# EAGLE design SPPM (EAGLE 6.3)
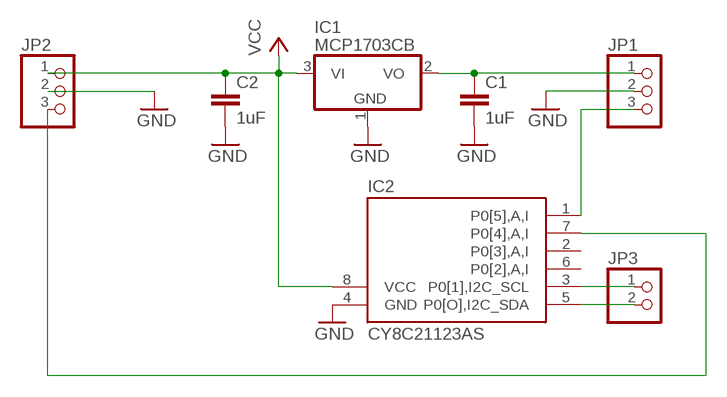
[diagram p0: schematic, sheet 1]

## Parts
C1  1uF  C-EUC0805  [C0805]
C2  1uF  C-EUC0805  [C0805]
IC1  MCP1703CB  [SOT23]
IC2  CY8C21123AS  [SOIC8]
JP1  PINHD-1X3  [1X03]
JP2  PINHD-1X3  [1X03]
JP3  PINHD-1X2  [1X02]

## Nets
GND [POWER]: C1.2 C2.2 IC1.1(GND) IC2.4(GND) JP1.2 JP2.2
N$1: IC2.7(P0[4],A,I) JP2.3
N$2: C1.1 IC1.2(VO) JP1.1
N$3: IC2.5(P0[O],I2C_SDA) JP3.2
N$4: IC2.3(P0[1],I2C_SCL) JP3.1
N$5: IC2.1(P0[5],A,I) JP1.3
VCC [POWER]: C2.1 IC1.3(VI) IC2.8(VCC) JP2.1
Unconnected: IC2.2(P0[3],A,I) IC2.6(P0[2],A,I)

## Library data of the parts
C1 C2 = rcl:C-EU: CAPACITOR, European symbol
IC1 = linear:MCP1703: 250 mA, 16V, Low Quiescent Current LDO Regulator Source: http://ww1.microchip.com/downloads/en/DeviceDoc/22049b.pdf
IC2 = rbl:CY8C21123: MICROCONTROLLER 4 Kbytes FLASH ROM; OC_FARNELL: unknown; OC_NEWARK: unknown
JP1 JP2 = pinhead:PINHD-1X3: PIN HEADER
JP3 = pinhead:PINHD-1X2: PIN HEADER

## Net classes
1 POWER: width 0.356 mm, clearance 0.305 mm

## Board
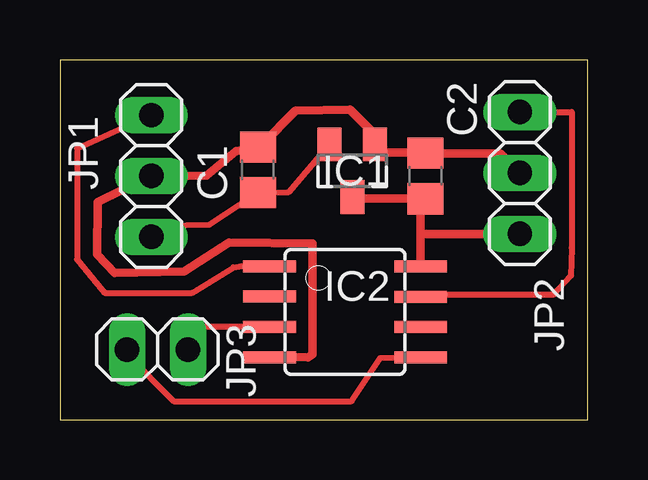
[diagram p1: board, top side]

Size 22 x 15 mm. Coordinates in mm from the lower left corner, seen from the top.
Outline: 0,0 22,0 22,15 0,15 0,0
Copper layers (1*16): Top 0.035mm / dielectric 1.5mm / Bottom 0.035mm
Design rules "LED *": minimum track width 10mil, minimum drill 0.8mm, track to track 18mil, track to pad 20mil, pad to pad 20mil, via to via 40mil, smd to smd 12mil, copper to edge 20mil, drill to drill 12mil, minimum pad ring 10mil, minimum via ring 10mil, stop-mask expansion 4mil, vias tented up to drill 0mil, thermal gap 10mil

### Footprints (pad centres in the part's own frame; a part is rotated, then mirrored left to right if it is on the bottom)
C0805 = smd 1.3 x 1.5: 1 -0.95,0; 2 0.95,0
SOT23 = smd 1 x 1.4: 1 -0.95,-1.1; 2 0.95,-1.1; 3 0,1.1
SOIC8 = smd 0.5 x 2.2: 1 -1.905,-3.154; 2 -0.645,-3.154; 3 0.625,-3.154; 4 1.895,-3.154; 5 1.905,3.154; 6 0.635,3.154; 7 -0.635,3.154; 8 -1.905,3.154
1X03 = drill 1.016 long: 1 -2.54,0; 2 0,0; 3 2.54,0
1X02 = drill 1.016 long: 1 -1.27,0; 2 1.27,0

### Placement (x,y rotation side)
C1  8.26,10.41 90 top
C2  15.24,10.16 90 top
IC1  12.19,10.38 180 top
IC2  11.89,4.49 270 top
JP1  3.81,10.16 90 top
JP2  19.18,10.29 90 top
JP3  4.06,2.92 180 top

### Tracks (layer width: path | path; a pad name or v marks a point on that pad's centre or on a via)
GND
  Top 0.356: IC1.1 13.16,11.46 13.49,11.12 15.24,11.12 C2.2 | 15.39,11.2 C2.2 | IC2.4 8.91,2.62 10.34,2.59 10.54,2.72 10.54,7.34 7.06,7.39 5.18,6.17 2.29,6.12 1.55,6.88 1.57,9.07 3.66,10.08 JP1.2 6.12,10.19 7.34,11.2 C1.2 8.41,11.46 9.83,12.88 12.09,12.93 13.03,11.99 IC1.1 | 13.11,11.66 IC1.1 | 13.08,11.81 IC1.1 | JP2.2 18.36,11.1 15.54,11.1 C2.2
N$1
  Top 0.254: 15.06,5.13 IC2.7 15.16,5.21 20.57,5.21 21.31,5.99 21.34,7.16 21.34,12.83 JP2.3
N$2
  Top 0.254: IC1.2 11.23,11.46 9.55,9.5 8.26,9.47 C1.1 8.15,9.4 6.22,8.13 4.29,8.1 JP1.1
N$3
  Top 0.254: JP3.2 2.79,2.72 4.75,0.76 12.17,0.76 13.36,2.56 IC2.5
N$4
  Top 0.254: JP3.1 5.92,3.89 8.36,3.89 8.71,3.86 IC2.3
N$5
  Top 0.254: JP1.3 0.71,11.3 0.71,6.68 1.85,5.28 5.51,5.28 7.24,6.35 7.57,6.4 8.71,6.38 IC2.1
VCC
  Top 0.356: IC1.3 12.24,9.22 C2.1 | 15.04,7.75 15.04,9.07 C2.1 | 15.04,7.75 IC2.8 | 15.42,9.25 C2.1 | 15.04,7.75 JP2.1